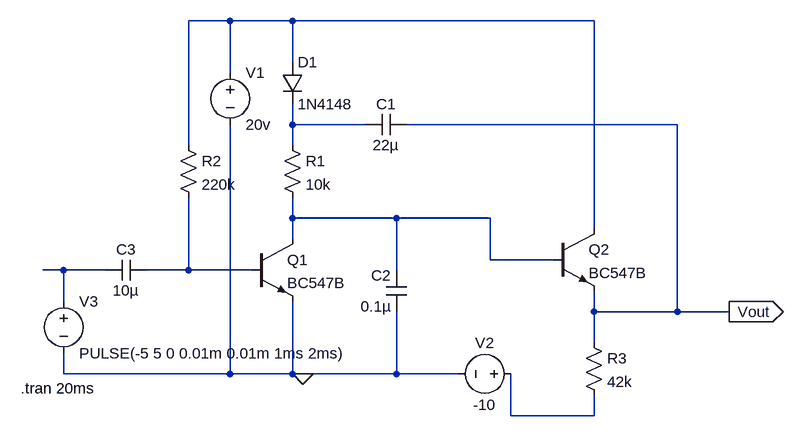
[diagram p0: schematic bootstrapSweep.asc]
bootstrapSweep.asc, the LTspice schematic file:
Version 4
SHEET 1 944 680
WIRE 16 -224 -48 -224
WIRE 112 -224 16 -224
WIRE 576 -224 112 -224
WIRE 112 -160 112 -224
WIRE 16 -144 16 -224
WIRE 112 -64 112 -96
WIRE 224 -64 112 -64
WIRE 704 -64 288 -64
WIRE -48 -32 -48 -224
WIRE 112 -32 112 -64
WIRE 112 80 112 48
WIRE 272 80 112 80
WIRE 416 80 272 80
WIRE 576 96 576 -224
WIRE 112 112 112 80
WIRE 416 144 416 80
WIRE 512 144 416 144
WIRE -240 160 -272 160
WIRE -176 160 -240 160
WIRE -48 160 -48 48
WIRE -48 160 -112 160
WIRE 48 160 -48 160
WIRE 272 160 272 80
WIRE -240 208 -240 160
WIRE 576 224 576 192
WIRE 704 224 704 -64
WIRE 704 224 576 224
WIRE 784 224 704 224
WIRE 576 272 576 224
WIRE -240 320 -240 288
WIRE 16 320 16 -64
WIRE 16 320 -240 320
WIRE 112 320 112 208
WIRE 112 320 16 320
WIRE 128 320 112 320
WIRE 272 320 272 224
WIRE 272 320 128 320
WIRE 368 320 272 320
WIRE 448 384 448 320
WIRE 576 384 576 352
WIRE 576 384 448 384
FLAG 128 320 0
FLAG 784 224 Vout
IOPIN 784 224 Out
SYMBOL npn 48 112 R0
SYMATTR InstName Q1
SYMATTR Value BC547B
SYMBOL npn 512 96 R0
SYMATTR InstName Q2
SYMATTR Value BC547B
SYMBOL res 96 -48 R0
SYMATTR InstName R1
SYMATTR Value 10k
SYMBOL res -64 -48 R0
SYMATTR InstName R2
SYMATTR Value 220k
SYMBOL res 560 256 R0
SYMATTR InstName R3
SYMATTR Value 42k
SYMBOL diode 96 -160 R0
SYMATTR InstName D1
SYMATTR Value 1N4148
SYMBOL cap 288 -80 R90
WINDOW 0 0 32 VBottom 2
WINDOW 3 32 32 VTop 2
SYMATTR InstName C1
SYMATTR Value 22µ
SYMBOL cap 288 224 R180
WINDOW 0 24 56 Left 2
WINDOW 3 24 8 Left 2
SYMATTR InstName C2
SYMATTR Value 0.1µ
SYMBOL cap -112 144 R90
WINDOW 0 0 32 VBottom 2
WINDOW 3 32 32 VTop 2
SYMATTR InstName C3
SYMATTR Value 10µ
SYMBOL voltage 16 -160 R0
SYMATTR InstName V1
SYMATTR Value 20v
SYMBOL voltage 464 320 R90
WINDOW 0 -32 56 VBottom 2
WINDOW 3 32 56 VTop 2
SYMATTR InstName V2
SYMATTR Value -10
SYMBOL voltage -240 192 R0
WINDOW 123 0 0 Left 0
WINDOW 39 0 0 Left 0
SYMATTR InstName V3
SYMATTR Value PULSE(-5 5 0 0.01m 0.01m 1ms 2ms)
TEXT -306 342 Left 2 !.tran 20ms

The netlist it stands for:
* bootstrapSweep.asc
Q1 N003 N005 0 0 BC547B
Q2 N001 N003 Vout 0 BC547B
R1 N002 N003 10k
R2 N001 N005 220k
R3 Vout N006 42k
D1 N001 N002 1N4148
C1 Vout N002 22µ
C2 0 N003 0.1µ
C3 N005 N004 10µ
V1 N001 0 20v
V2 N006 0 -10
V3 N004 0 PULSE(-5 5 0 0.01m 0.01m 1ms 2ms)
.model D D
.lib standard.dio
.model NPN NPN
.model PNP PNP
.lib standard.bjt
.tran 20ms
.backanno
.end